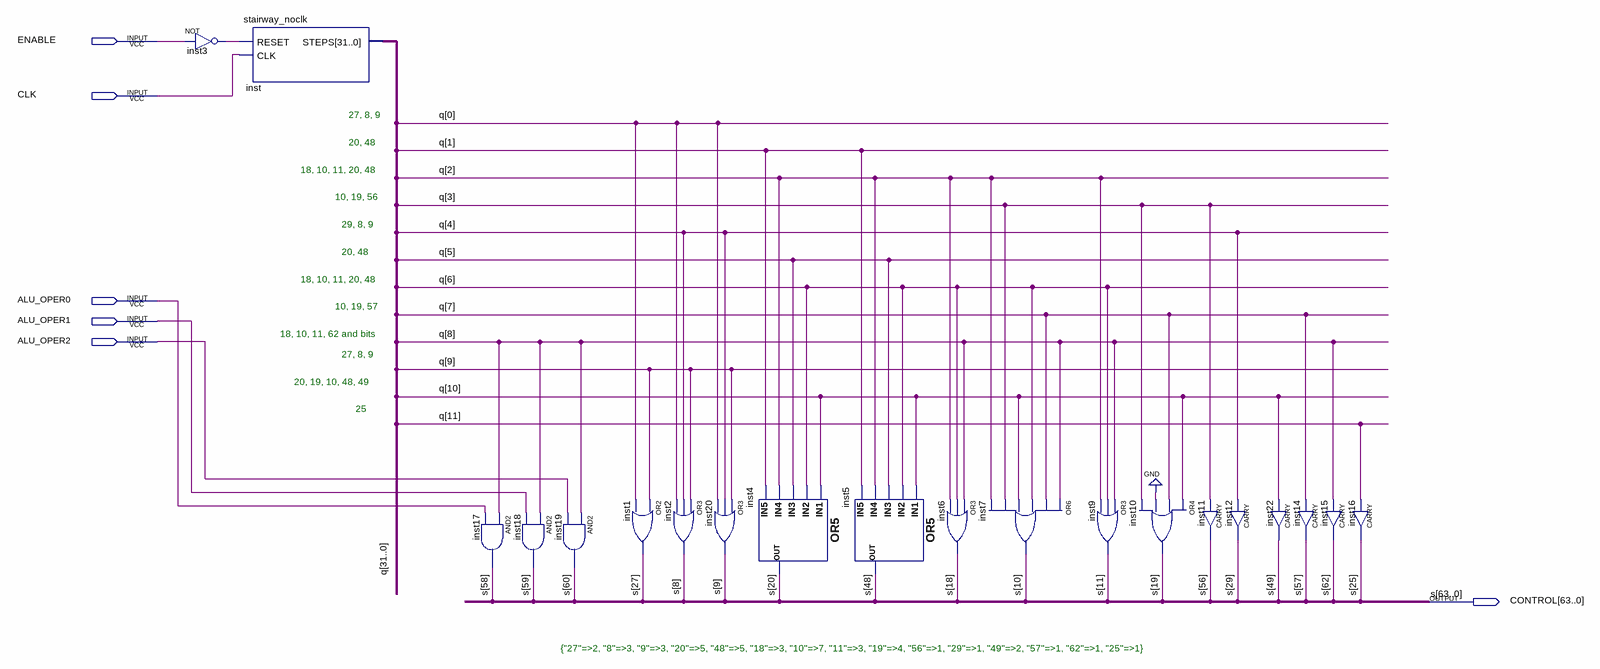
[diagram p0: schematic sheet]
// Quartus schematic macro_alu_2.bdf as structural Verilog: 20 symbols, 6 pins
module macro_alu_2 (
  input  ENABLE,
  input  CLK,
  input  ALU_OPER0,
  input  ALU_OPER1,
  input  ALU_OPER2,
  output [63:0] CONTROL
);

  wire inst3_out;
  wire [31:0] q;

  not inst3 (inst3_out, ENABLE);
  stairway_noclk inst (.RESET(inst3_out), .CLK(CLK), .STEPS(q));
  and inst17 (CONTROL[58], q[8], ALU_OPER0);
  and inst18 (CONTROL[59], q[8], ALU_OPER1);
  and inst19 (CONTROL[60], q[8], ALU_OPER2);
  or inst1 (CONTROL[27], q[9], q[0]);
  or inst2 (CONTROL[8], q[9], q[4], q[0]);
  or inst20 (CONTROL[9], q[9], q[4], q[0]);
  or inst4 (CONTROL[20], q[10], q[6], q[5], q[2], q[1]);
  or inst5 (CONTROL[48], q[10], q[6], q[5], q[2], q[1]);
  or inst6 (CONTROL[18], q[8], q[6], q[2]);
  or inst7 (CONTROL[10], q[8], q[7], q[6], q[10], q[3], q[2]);
  or inst9 (CONTROL[11], q[8], q[6], q[2]);
  or inst10 (CONTROL[19], q[10], q[7], 1'b0, q[3]);
  CARRY inst11 (.IN(q[3]), .OUT(CONTROL[56]));
  CARRY inst12 (.IN(q[4]), .OUT(CONTROL[29]));
  CARRY inst22 (.IN(q[10]), .OUT(CONTROL[49]));
  CARRY inst14 (.IN(q[7]), .OUT(CONTROL[57]));
  CARRY inst15 (.IN(q[8]), .OUT(CONTROL[62]));
  CARRY inst16 (.IN(q[11]), .OUT(CONTROL[25]));

  // Other names for the same wires on the sheet: s[63:0] = CONTROL

  // Notes on the sheet:
  //   27, 8, 9
  //   20, 48
  //   18, 10, 11, 20, 48
  //   10, 19, 56
  //   29, 8, 9
  //   20, 48
  //   18, 10, 11, 20, 48
  //   10, 19, 57
  //   18, 10, 11, 62 and bits
  //   27, 8, 9
  //   20, 19, 10, 48, 49
  //   25
  //   {"27"=>2, "8"=>3, "9"=>3, "20"=>5, "48"=>5, "18"=>3, "10"=>7, "11"=>3, "19"=>4, "56"=>1, "29"=>1, "49"=>2, "57"=>1, "62"=>1, "25"=>1}
endmodule
